# Altium schematic sheet 27 Clock 2.SchDoc
size 420 x 297 mm
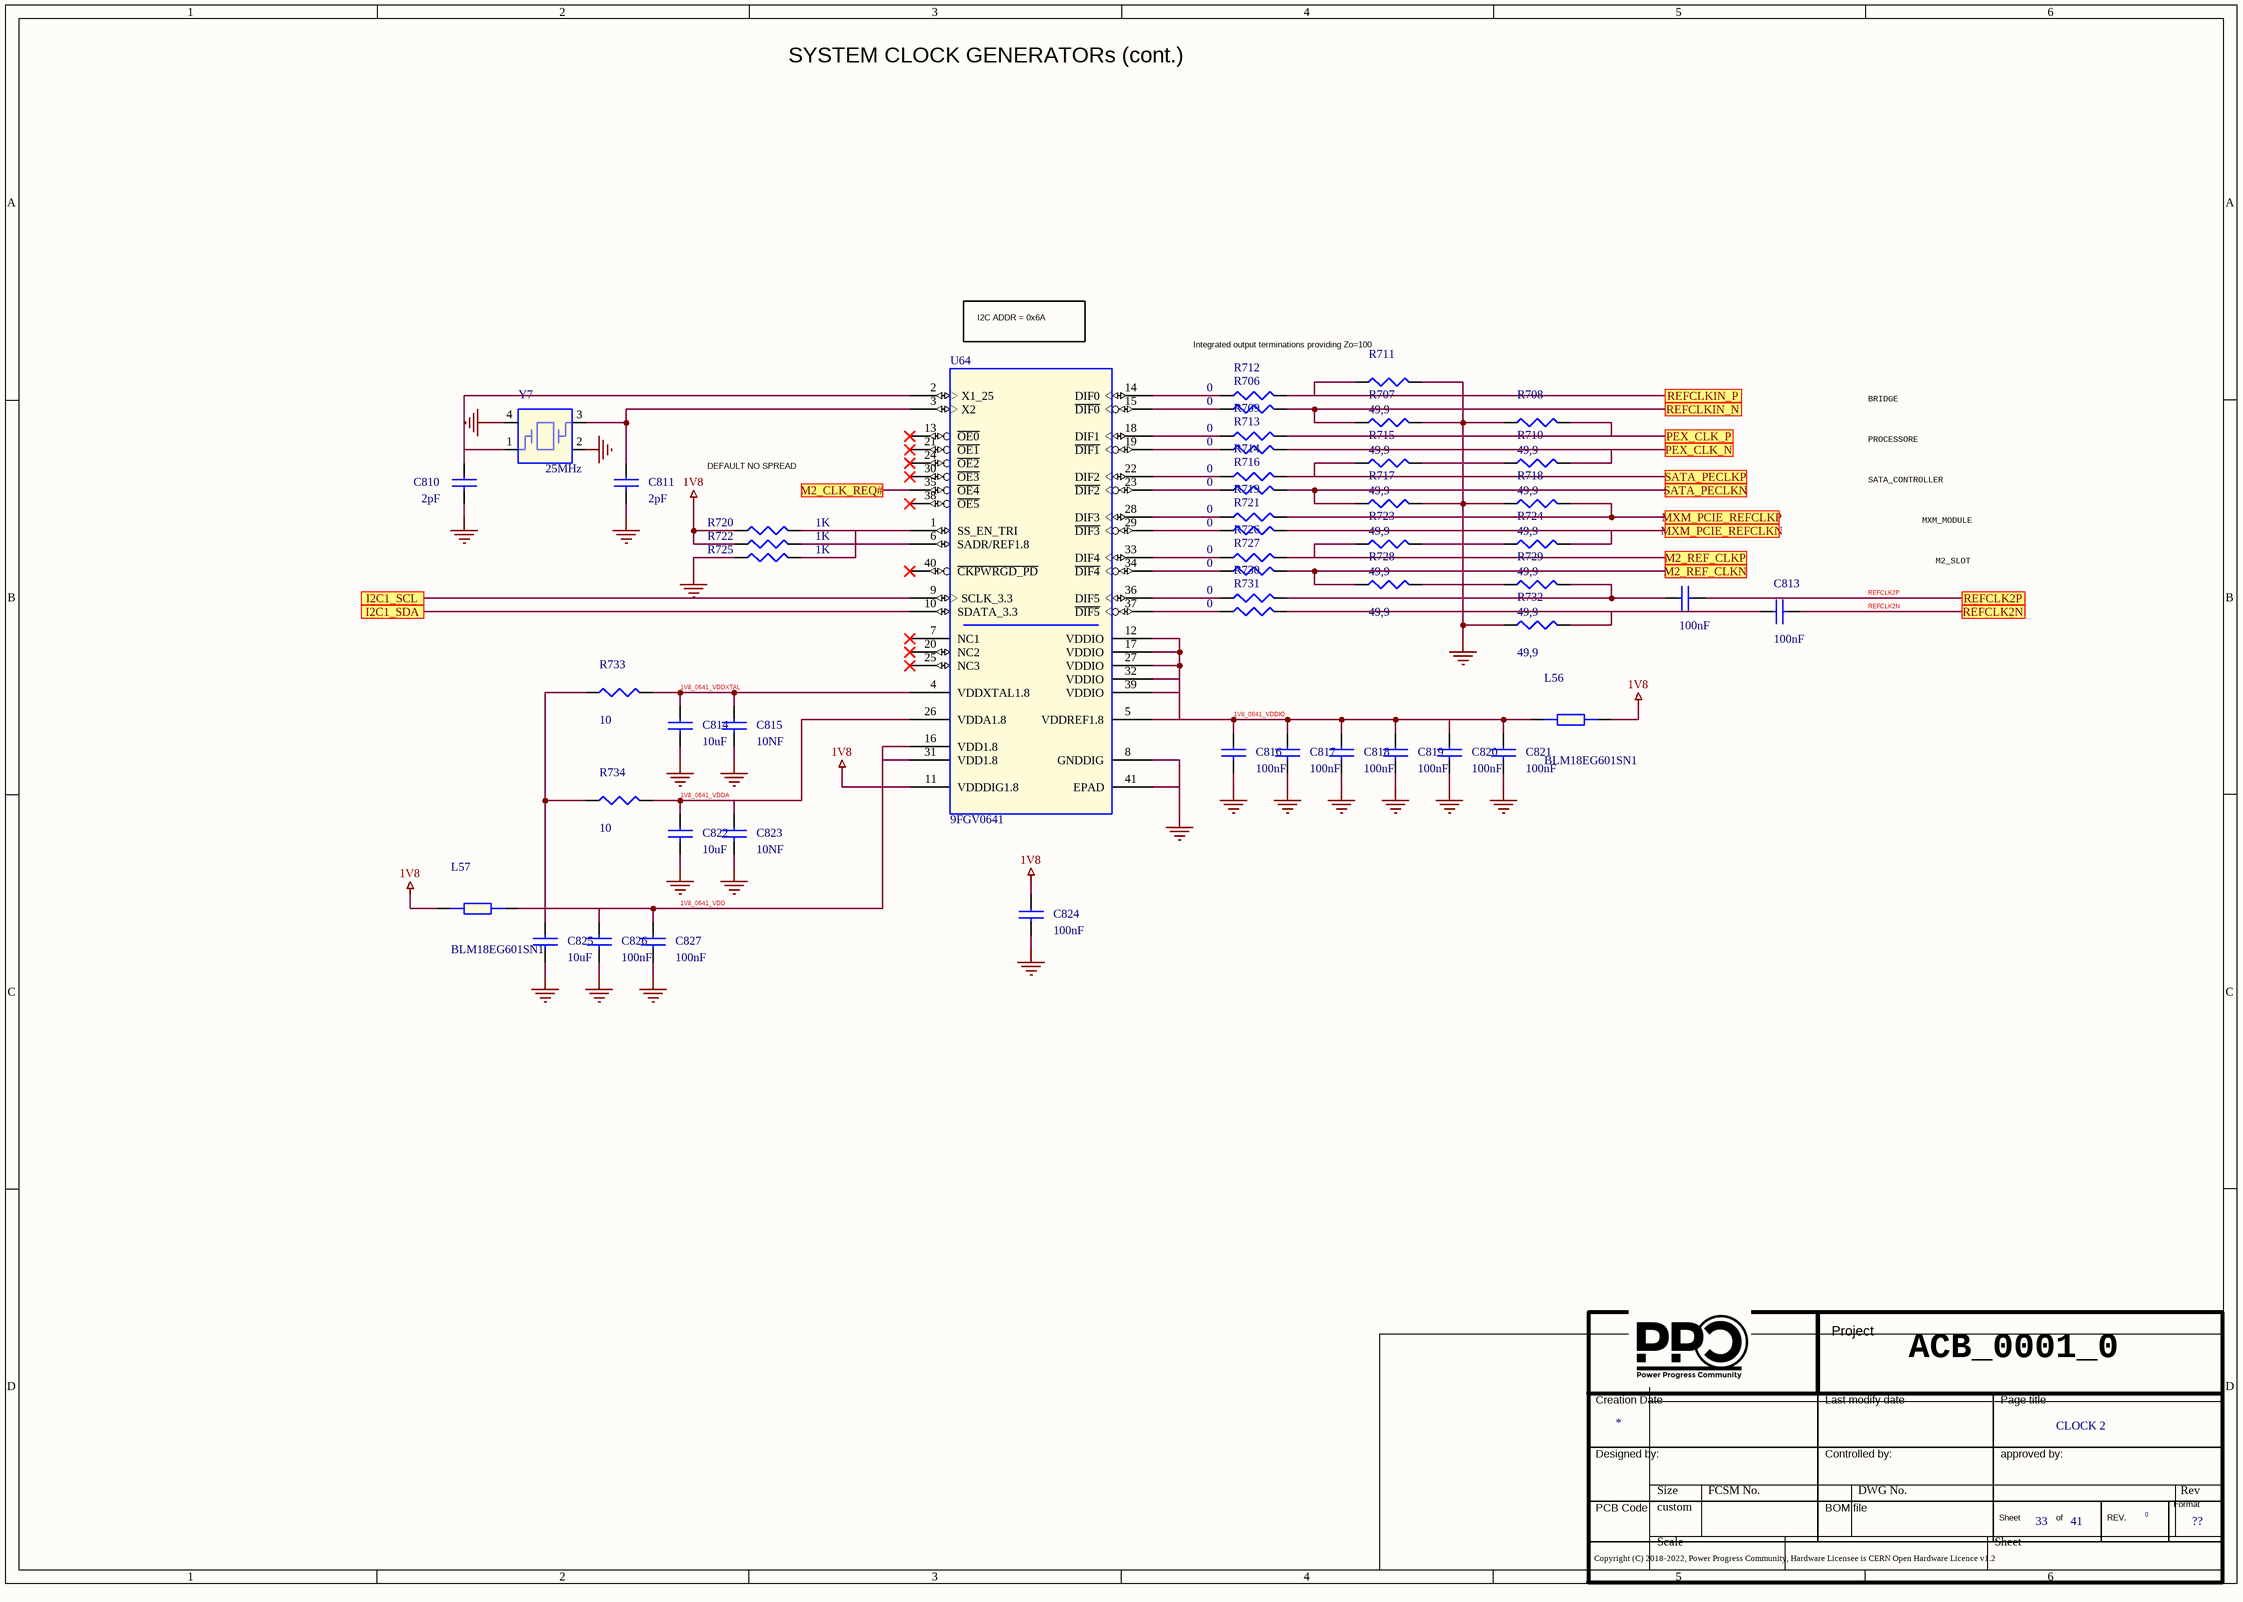
[diagram p0: 27 Clock 2.SchDoc]

## Parts
*  Doc: CLOCK 2  Page Count: 41  Page Number: 33  Page Size: ??  RevCode: 0  (hidden comment: Title_block_PPC)  (graphical)
C810  2pF  [SMD_0402]
C811  2pF  [SMD_0402]
C812  100nF  [SMD_0402]
C813  100nF  [SMD_0402]
C814  10uF  [SMD_0603]
C815  10NF  [SMD_0402]
C816  100nF  [SMD_0402]
C817  100nF  [SMD_0402]
C818  100nF  [SMD_0402]
C819  100nF  [SMD_0402]
C820  100nF  [SMD_0402]
C821  100nF  [SMD_0402]
C822  10uF  [SMD_0603]
C823  10NF  [SMD_0402]
C824  100nF  [SMD_0402]
C825  10uF  [SMD_0603]
C826  100nF  [SMD_0402]
C827  100nF  [SMD_0402]
L56  BLM18EG601SN1  [SMD_0603]
L57  BLM18EG601SN1  [SMD_0603]
R706  0  [SMD_0402]
R707  49,9  [SMD_0402]
R708  49,9  [SMD_0402]
R709  0  [SMD_0402]
R710  49,9  [SMD_0402]
R711  49,9  [SMD_0402]
R712  0  [SMD_0402]
R713  0  [SMD_0402]
R714  0  [SMD_0402]
R715  49,9  [SMD_0402]
R716  0  [SMD_0402]
R717  49,9  [SMD_0402]
R718  49,9  [SMD_0402]
R719  0  [SMD_0402]
R720  1K  [SMD_0402]
R721  0  [SMD_0402]
R722  1K  [SMD_0402]
R723  49,9  [SMD_0402]
R724  49,9  [SMD_0402]
R725  1K  [SMD_0402]
R726  0  [SMD_0402]
R727  0  [SMD_0402]
R728  49,9  [SMD_0402]
R729  49,9  [SMD_0402]
R730  0  [SMD_0402]
R731  0  [SMD_0402]
R732  49,9  [SMD_0402]
R733  10  [SMD_0402]
R734  10  [SMD_0402]
U64  9FGV0641  [qfn_p040_d040_b500_40_e380]
Y7  25MHz  [SMD_5.0x3.2]

## Ports
I2C1_SCL, I2C1_SDA, M2_CLK_REQ#, M2_REF_CLKN, M2_REF_CLKP, MXM_PCIE_REFCLKN, MXM_PCIE_REFCLKP, PEX_CLK_N, PEX_CLK_P, REFCLK2N, REFCLK2P, REFCLKIN_N, REFCLKIN_P, SATA_PECLKN, SATA_PECLKP

## Nets
1V8: C824.1 L56.2 L57.1 R720.1 R722.1 U64.11(VDDDIG1.8)
GND: C810.2 C811.2 C814.2 C815.2 C816.2 C817.2 C818.2 C819.2 C820.2 C821.2 C822.2 C823.2 C824.2 C825.2 C826.2 C827.2 R707.2 R708.1 R710.1 R711.2 R715.2 R717.2 R718.1 R723.2 R724.1 R725.1 R728.2 R729.1 R732.1 U64.8(GNDDIG) U64.41(EPAD) Y7.2 Y7.4
1V8_0641_VDD: C825.1 C826.1 C827.1 L57.2 R733.1 R734.1 U64.16(VDD1.8) U64.31(VDD1.8)
1V8_0641_VDDA: C822.1 C823.1 R734.2 U64.26(VDDA1.8)
1V8_0641_VDDIO: C816.1 C817.1 C818.1 C819.1 C820.1 C821.1 L56.1 U64.5(VDDREF1.8) U64.12(VDDIO) U64.17(VDDIO) U64.27(VDDIO) U64.32(VDDIO) U64.39(VDDIO)
1V8_0641_VDDXTAL: C814.1 C815.1 R733.2 U64.4(VDDXTAL1.8)
I2C1_SCL: U64.9(SCLK_3.3) ; port I2C1_SCL
I2C1_SDA: U64.10(SDATA_3.3) ; port I2C1_SDA
M2_CLK_REQ#: U64.35(~{OE4}) ; port M2_CLK_REQ#
M2_REF_CLKN: R727.2 R728.1 ; port M2_REF_CLKN
M2_REF_CLKP: R723.1 R726.2 ; port M2_REF_CLKP
MXM_PCIE_REFCLKN: R721.2 R724.2 ; port MXM_PCIE_REFCLKN
MXM_PCIE_REFCLKP: R718.2 R719.2 ; port MXM_PCIE_REFCLKP
PEX_CLK_N: R710.2 R713.2 ; port PEX_CLK_N
PEX_CLK_P: R708.2 R709.2 ; port PEX_CLK_P
REFCLK2N: C813.2 ; port REFCLK2N
REFCLK2P: C812.2 ; port REFCLK2P
REFCLKIN_N: R706.2 R707.1 ; port REFCLKIN_N
REFCLKIN_P: R711.1 R712.2 ; port REFCLKIN_P
SATA_PECLKN: R716.2 R717.1 ; port SATA_PECLKN
SATA_PECLKP: R714.2 R715.1 ; port SATA_PECLKP
NetC810_1: C810.1 U64.2(X1_25) Y7.1
NetC811_1: C811.1 U64.3(X2) Y7.3
NetC812_1: C812.1 R729.2 R730.2
NetC813_1: C813.1 R731.2 R732.2
NetR706_1: R706.1 U64.15(~{DIF0})
NetR709_1: R709.1 U64.18(DIF1)
NetR712_1: R712.1 U64.14(DIF0)
NetR713_1: R713.1 U64.19(~{DIF1})
NetR714_1: R714.1 U64.22(DIF2)
NetR716_1: R716.1 U64.23(~{DIF2})
NetR719_1: R719.1 U64.28(DIF3)
NetR720_2: R720.2 R725.2 U64.1(SS_EN_TRI)
NetR721_1: R721.1 U64.29(~{DIF3})
NetR722_2: R722.2 U64.6(SADR/REF1.8)
NetR726_1: R726.1 U64.33(DIF4)
NetR727_1: R727.1 U64.34(~{DIF4})
NetR730_1: R730.1 U64.36(DIF5)
NetR731_1: R731.1 U64.37(~{DIF5})

Not connected (* = marked no-connect by the designer): U64 7(NC1)* 13(~{OE0})* 20(NC2)* 21(~{OE1})* 24(~{OE2})* 25(NC3)* 30(~{OE3})* 38(~{OE5})* 40(~{CKPWRGD_PD})*

## Notes on the sheet
- SYSTEM CLOCK GENERATORs (cont.)
- I2C ADDR = 0x6A
- Integrated output terminations providing Zo=100
- BRIDGE
- PROCESSORE
- DEFAULT NO SPREAD
- SATA_CONTROLLER
- MXM_MODULE
- M2_SLOT
- ACB_0001_0
- (in symbol Title_block_PPC) Project; Creation Date; Last modify date; Page title; Designed by:; Controlled by:; approved by:; Format; PCB Code; BOM file; Sheet; of; REV.; Copyright (C) 2018-2022, Power Progress Community, Hardware Licensee is CERN Open Hardware Licence v1.2

## Library data of the parts
* = Title_block_PPC: Title: T2080PCIe; Author: MICETEK; Page Create Date: March  8, 1995; Page Title: ?; Page Modify Date: *
C810 = CAP NP_Dup3: CAP CER 2PF 50V C0G/NPO 0402; Part Number: PASSIVE_1453; Manufacturer 1: YAGEO; Manufacturer Part Number 1: CC0402CRNPO9BN2R0D; RSM: RC0402; Part Type: Capacitors\Ceramic\SMD\0402; PCB Footprint: SMD_0402
C811 = CAP NP_Dup3: CAP CER 2PF 50V C0G/NPO 0402; Manufacturer Part Number 1: CC0402CRNPO9BN2R0D; Manufacturer 1: YAGEO; Part Number: PASSIVE_1453; RSM: RC0402; PCB Footprint: SMD_0402; Part Type: Capacitors\Ceramic\SMD\0402
C812 C813 = CAP NP_Dup3: COND.CER. 100NF 50V 0402 X7R SMD; Manufacturer Part Number 1: CGA2B3X7R1H104M050BD; Manufacturer 1: TDK; Part Number: PASSIVE_24; RSM: RC0402; PCB Footprint: SMD_0402; Part Type: Capacitors\Ceramic\SMD\0402
C814 C822 C825 = CAP NP_Dup3: COND.CER.10uF 0603 25V SMD; Manufacturer Part Number 1: CL10A106MA8NRNC; Manufacturer 1: SAMSUNG; Part Number: PASSIVE_124; RSM: RC0603; PCB Footprint: SMD_0603; Part Type: Capacitors\Ceramic\SMD\0603
C815 C823 = CAP NP_Dup3: COND.CER. 10NF 16V 0402 X7R SMD; Part Number: PASSIVE_28; Manufacturer 1: AVX; Manufacturer Part Number 1: 0402YC103KAT2A; RSM: RC0402; Part Type: Capacitors\Ceramic\SMD\0402; PCB Footprint: SMD_0402
C816-C821 C824 C826 C827 = CAP NP_Dup3: COND.CER. 100NF 50V 0402 X7R SMD; Part Number: PASSIVE_24; Manufacturer 1: TDK; Manufacturer Part Number 1: CGA2B3X7R1H104M050BD; RSM: RC0402; Part Type: Capacitors\Ceramic\SMD\0402; PCB Footprint: SMD_0402
L56 L57 = FERRITE_BEAD: FERRITE BEAD 600ohm 500mA 0603 SMD; Manufacturer Part Number 1: BLM18EG601SN1 SMD; Manufacturer 1: Murata; Part Number: PASSIVE_377; RSM: RC0603; Part Type: Ferrite Beads\SMD\0603; PCB Footprint: SMD_0603
R706 R709 R712-R714 R716 R719 R721 R726 R727 R730 R731 = R_Dup6: RESIS.CHIP 0R 5% 0402 SMD; Part Number: PASSIVE_805; Manufacturer 1: ROYAL OHM; RSM: RC0402; Part Type: Resistors\Fixed\SMD\0402\5%; Manufacturer Part Number 1: RESIS.CHIP 0R 5% 0402 SMD; PCB Footprint: SMD_0402
R707 R708 R710 R711 R715 R717 R718 R723 R724 R728 R729 R732 = R_Dup6: RESIS.CHIP 49,9R 1% 0402 SMD; Manufacturer Part Number 1: NCR04F49R9TRF; Manufacturer 1: NIC; Part Number: PASSIVE_738; RSM: RC0402; Part Type: Resistors\Fixed\SMD\0402\1%; PCB Footprint: SMD_0402
R720 R722 R725 = R_Dup6: RESIS.CHIP 1K 1% 0402 SMD; Part Number: PASSIVE_628; Manufacturer 1: ROYAL OHM; RSM: RC0402; Part Type: Resistors\Fixed\SMD\0402\1%; Manufacturer Part Number 1: RESIS.CHIP 1K 1% 0402 SMD; PCB Footprint: SMD_0402
R733 R734 = R_Dup6: RESIS.CHIP 10R 5% 0402 SMD; Manufacturer 1: ROYAL OHM; Part Number: PASSIVE_811; RSM: RC0402; Manufacturer Part Number 1: RESIS.CHIP 10R 5% 0402 SMD; Part Type: Resistors\Fixed\SMD\0402\5%; PCB Footprint: SMD_0402
U64 = IDT9FGV0641: PCIe Gen1–4 clock generation for Riser Cards; Manufacturer 1: IDT; Part Number: LOGIC_359; MPN: 9FGV0641AKLF; RSM: QFN-40-5X5-P0_4-EP; PCB Footprint: 40-VFQFPN; Distributor 1: IDT; Manufacturer Part Number 1: 9FGV0641; Part Type: CLOCK\GENERATOR; TYPE: IC; Vendor: IDT
Y7 = CRYSTAL_4P: CRYSTAL 25.000 MHZ 20PF SMD; Manufacturer Part Number 1: ECS-250-20-30B-TR (ROHS COMPLIANT); Manufacturer 1: ECS; Part Number: MISC_166; RSM: XC-CSX2; PCB Footprint: SMD_5.0x3.2; Distributor 1: DIGIKEY (XC1124CT-ND); Part Type: Quartz